# Altium schematic sheet tps62130.SchDoc: PWR
size A4; Date: 02.10.2025; CheckedBy: BCY; DrawnBy: miaow; DocumentNumber: 2; Revision: v0.0.1; SheetNumber: 2; SheetTotal: 12; Sample: A0; Url: github.com/miaow-cn/pcb-lib; Liscense: GPLv3; Board: MAIOW FOC BOARD; BoardType: MAIN_PCB; Desc: dc-dc syncronize buck converter
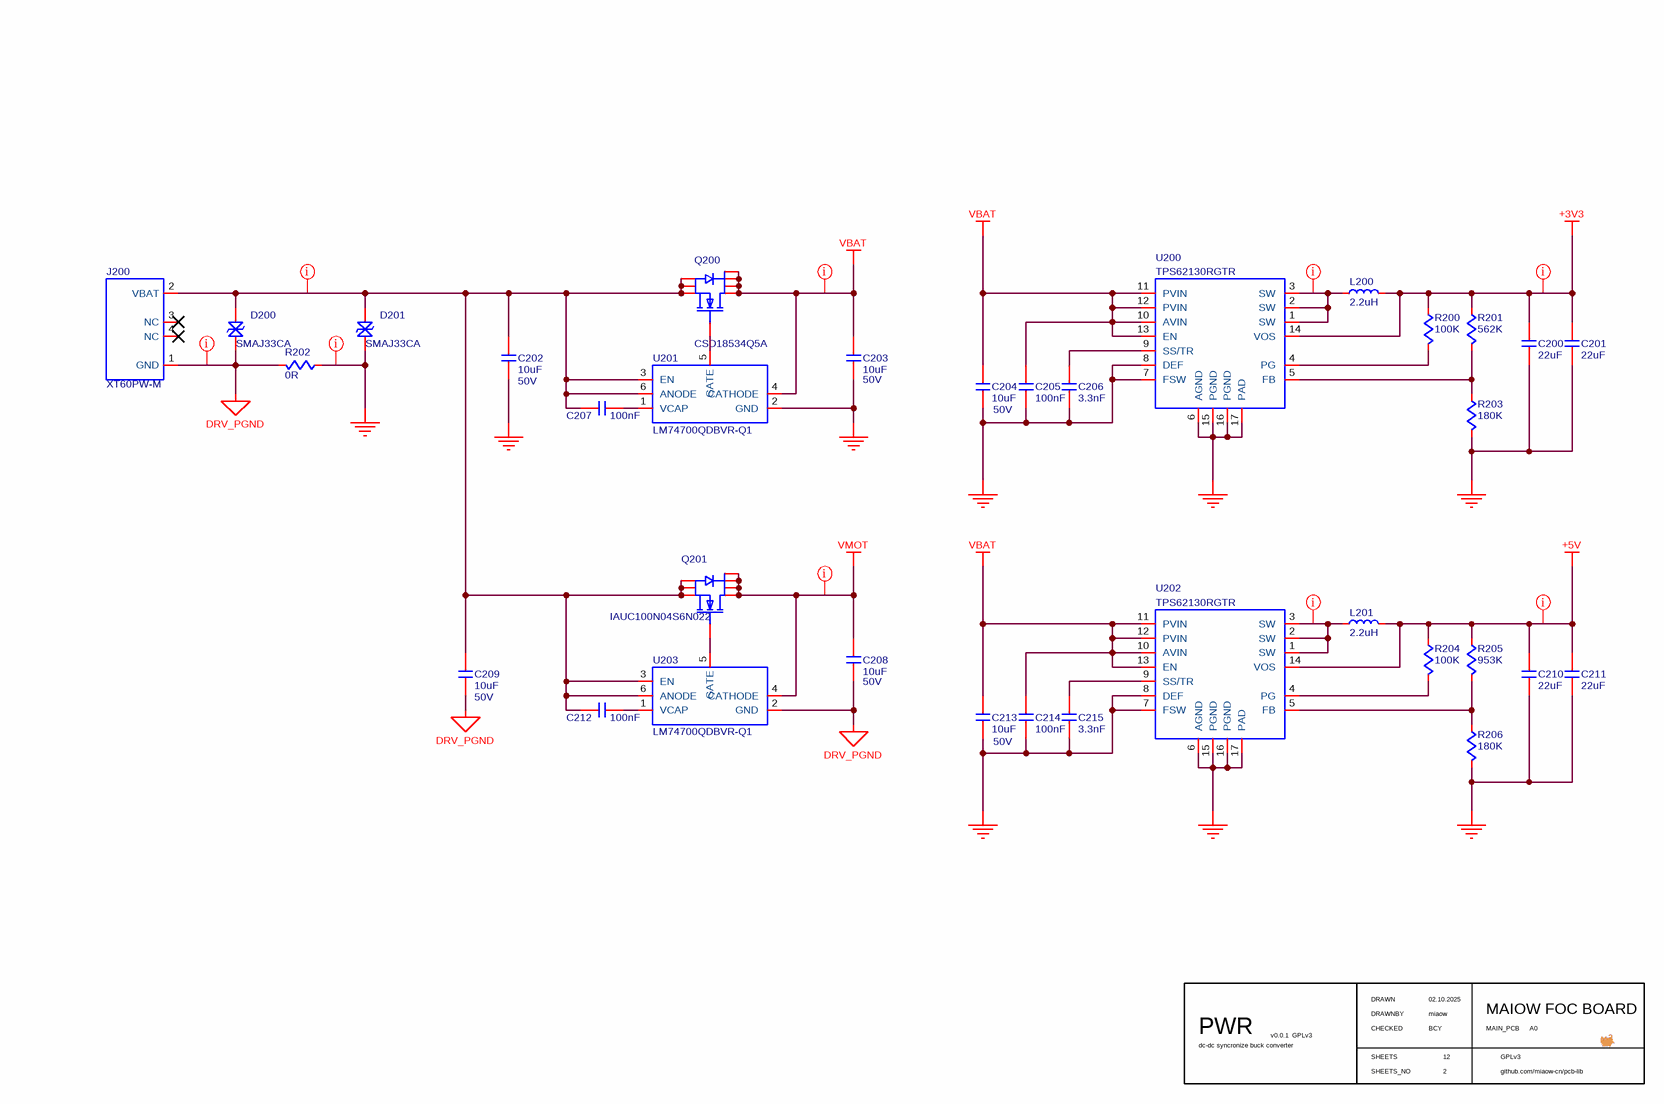
[diagram p0: tps62130.SchDoc]

## Parts
C200  value 22uF  [C0805]  (hidden comment: C-NOMO)
C201  value 22uF  [C0805]  (hidden comment: C-NOMO)
C202  value 10uF  voltage: 50V  [C0805]  (hidden comment: C-NOMO)
C203  value 10uF  voltage: 50V  [C0805]  (hidden comment: C-NOMO)
C204  value 10uF  voltage: 50V  [C0805]  (hidden comment: C-NOMO)
C205  value 100nF  [C0603]  (hidden comment: C-NOMO)
C206  value 3.3nF  [C0402]  (hidden comment: C-NOMO)
C207  value 100nF  [C0402]  (hidden comment: C-NOMO)
C208  value 10uF  voltage: 50V  [C0805]  (hidden comment: C-NOMO)
C209  value 10uF  voltage: 50V  [C0805]  (hidden comment: C-NOMO)
C210  value 22uF  [C0805]  (hidden comment: C-NOMO)
C211  value 22uF  [C0805]  (hidden comment: C-NOMO)
C212  value 100nF  [C0402]  (hidden comment: C-NOMO)
C213  value 10uF  voltage: 50V  [C0805]  (hidden comment: C-NOMO)
C214  value 100nF  [C0603]  (hidden comment: C-NOMO)
C215  value 3.3nF  [C0402]  (hidden comment: C-NOMO)
D200  SMAJ33CA  [SMAJ33CA]
D201  SMAJ33CA  [SMAJ33CA]
J200  XT60PW-M  [XT60PW-M]
L200  value 2.2uH  [FXL0420]  (hidden comment: L)
L201  value 2.2uH  [FXL0420]  (hidden comment: L)
Q200  CSD18534Q5A  [CSD18534Q5A]
Q201  IAUC100N04S6N022  [IAUC100N04S6N022]
R200  value 100K  [R0402]  (hidden comment: R)
R201  value 562K  [R0603]  (hidden comment: R)
R202  value 0R  [R1206]  (hidden comment: R)
R203  value 180K  [R0603]  (hidden comment: R)
R204  value 100K  [R0402]  (hidden comment: R)
R205  value 953K  [R0603]  (hidden comment: R)
R206  value 180K  [R0603]  (hidden comment: R)
U200  TPS62130RGTR  [TPS62130RGTR]
U201  LM74700QDBVR-Q1  [LM74700QDBVR-Q1]
U202  TPS62130RGTR  [TPS62130RGTR]
U203  LM74700QDBVR-Q1  [LM74700QDBVR-Q1]

## Nets
+3V3: C200.2 C201.2 L200.2 R200.2 R201.2 U200.14(VOS)
+5V: C210.2 C211.2 L201.2 R204.2 R205.2 U202.14(VOS)
DRV_PGND: C208.1 C209.1 D200.1 J200.1(GND) R202.1 U203.2(GND)
GND: C200.1 C201.1 C202.1 C203.1 C204.1 C205.1 C206.1 C210.1 C211.1 C213.1 C214.1 C215.1 D201.1 R202.2 R203.1 R206.1 U200.6(AGND) U200.7(FSW) U200.8(DEF) U200.15(PGND) U200.16(PGND) U200.17(PAD) U201.2(GND) U202.6(AGND) U202.7(FSW) U202.8(DEF) U202.15(PGND) U202.16(PGND) U202.17(PAD)
VBAT: C203.2 C204.2 C205.2 C213.2 C214.2 Q200.5(D) Q200.6(D) Q200.7(D) Q200.8(D) U200.10(AVIN) U200.11(PVIN) U200.12(PVIN) U200.13(EN) U201.4(CATHODE) U202.10(AVIN) U202.11(PVIN) U202.12(PVIN) U202.13(EN)
VMOT: C208.2 Q201.5(D) Q201.6(D) Q201.7(D) Q201.8(D) U203.4(CATHODE)
NetC202_2: C202.2 C207.1 C209.2 C212.1 D200.2 D201.2 J200.2(VBAT) Q200.1(S) Q200.2(S) Q200.3(S) Q201.1(S) Q201.2(S) Q201.3(S) U201.3(EN) U201.6(ANODE) U203.3(EN) U203.6(ANODE)
NetC206_2: C206.2 U200.9(SS/TR)
NetC207_2: C207.2 U201.1(VCAP)
NetC212_2: C212.2 U203.1(VCAP)
NetC215_2: C215.2 U202.9(SS/TR)
NetL200_1: L200.1 U200.1(SW) U200.2(SW) U200.3(SW)
NetL201_1: L201.1 U202.1(SW) U202.2(SW) U202.3(SW)
NetQ200_4: Q200.4(G) U201.5(GATE)
NetQ201_4: Q201.4(G) U203.5(GATE)
NetR200_1: R200.1 U200.4(PG)
NetR201_1: R201.1 R203.2 U200.5(FB)
NetR204_1: R204.1 U202.4(PG)
NetR205_1: R205.1 R206.2 U202.5(FB)

Not connected (* = marked no-connect by the designer): J200 3(NC)* 4(NC)*

## Layout directives
net class CLS_PWR: +3V3, +5V, DRV_PGND, GND, NetC202_2, NetL200_1, NetL201_1, VBAT, VMOT

## Notes on the sheet
- DRAWN
- CHECKED
- DRAWNBY
- SHEETS
- SHEETS_NO

## Library data of the parts
C200 C201 C205-C207 C210-C212 C214 C215 = C-NOMO: voltage: 25V; precision: 5%
C202-C204 C208 C209 C213 = C-NOMO: precision: 5%
D200 D201 = SMAJ33CA: TVS/ESD; Supplier 1: LCSC; Supplier Part Number 1: C316048
J200 = XT60PW-M: CONNECTOR - dc supply; Supplier 1: LCSC; Supplier Part Number 1: C98732
L200 L201 = L: Code_IEC: 1005; Published: 8-Jun-2000; LatestRevisionDate: 29-May-2009; LatestRevisionNote: IPC-7351 Footprint Added.; PackageReference: 0402-A; Publisher: Altium Limited; PackageDescription: Chip Inductor; Code_JEITA: 0402
Q200 = CSD18534Q5A: NMOS; Supplier 1: LCSC; Supplier Part Number 1: C115943
Q201 = IAUC100N04S6N022: NMOS; Supplier 1: LCSC; Supplier Part Number 1: C535695
R200-R206 = R: precision: 1%
U201 U203 = LM74700QDBVR-Q1: IDEAL DIODE; Supplier Part Number 1: C2941042; Supplier 1: LCSC
U200 U202 = TPS62130RGTR: Supplier 1: LCSC; Supplier Part Number 1: C43590